# Altium schematic sheet [5]_Power_Supply.SchDoc: Power Supply
size A3; Author: Eladio Delgado Mingorance; CompanyName: Mareldem Technologies; Organization: Mareldem Technologies; Revision: 1.0A; SheetNumber: 5; SheetTotal: 5
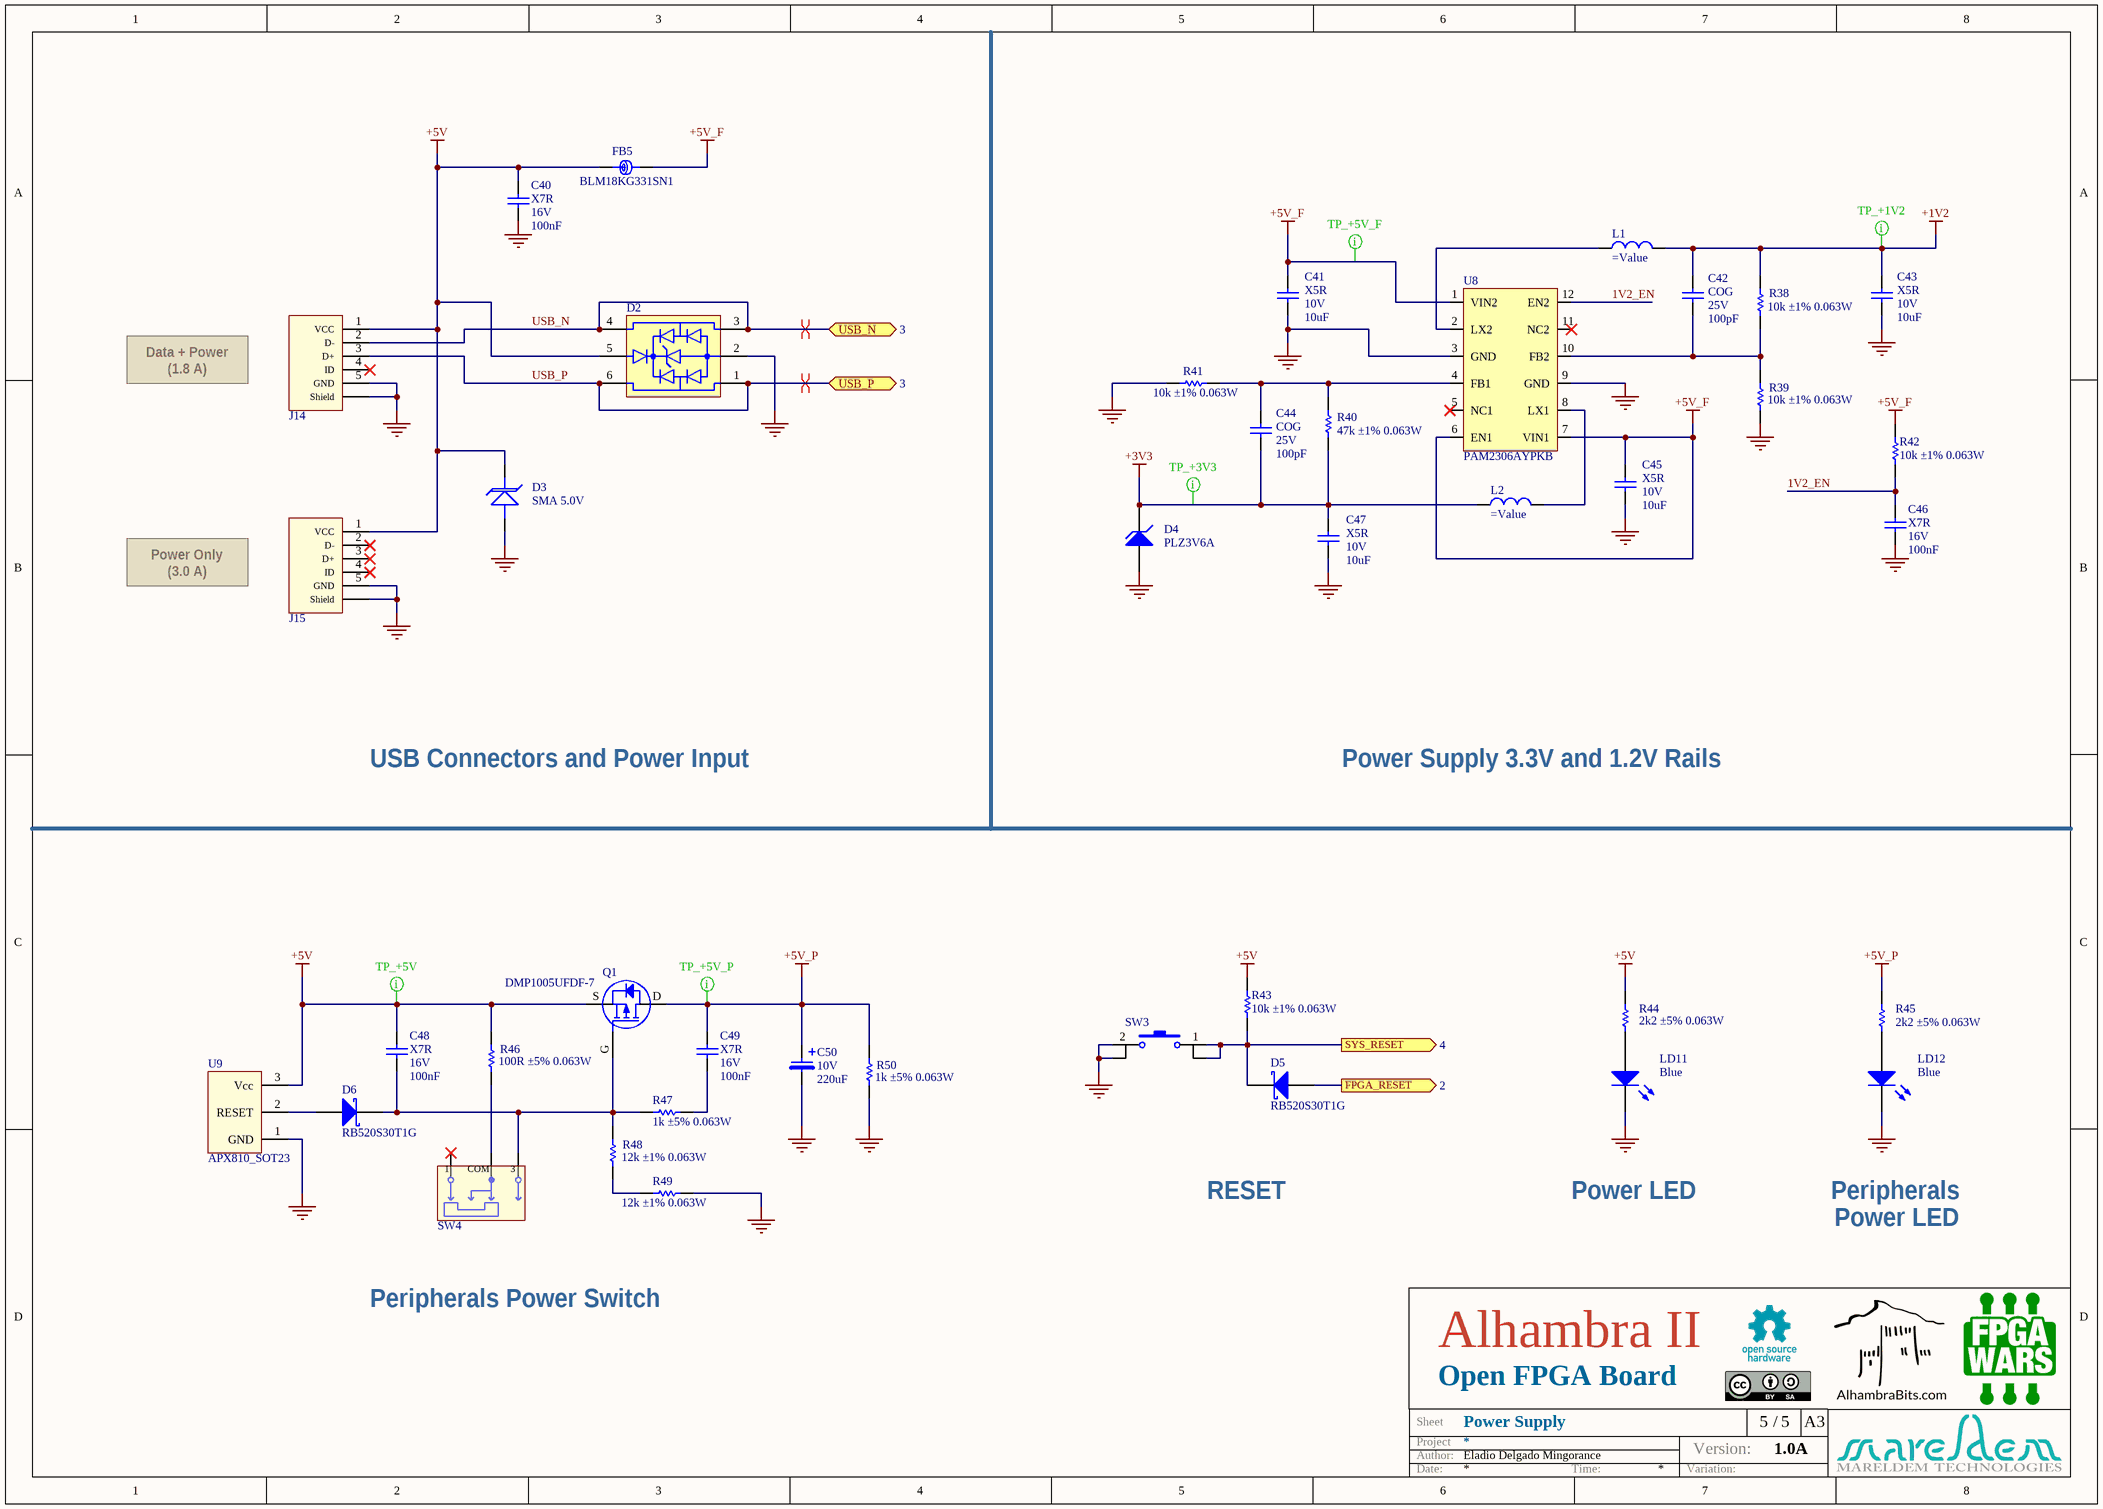
[diagram p0: [5]_Power_Supply.SchDoc]

## Parts
C40  Dielectric: X7R  Voltage: 16V  Capacitance: 100nF  [C0402]  (hidden comment: Capacitor)
C41  Dielectric: X5R  Voltage: 10V  Capacitance: 10uF  [C0805_1.25_HD]  (hidden comment: Capacitor)
C42  Dielectric: COG  Voltage: 25V  Capacitance: 100pF  [C0402]  (hidden comment: Capacitor)
C43  Dielectric: X5R  Voltage: 10V  Capacitance: 10uF  [C0603]  (hidden comment: Capacitor)
C44  Dielectric: COG  Voltage: 25V  Capacitance: 100pF  [C0402]  (hidden comment: Capacitor)
C45  Dielectric: X5R  Voltage: 10V  Capacitance: 10uF  [C0805_1.25_HD]  (hidden comment: Capacitor)
C46  Dielectric: X7R  Voltage: 16V  Capacitance: 100nF  [C0402]  (hidden comment: Capacitor)
C47  Dielectric: X5R  Voltage: 10V  Capacitance: 10uF  [C0805_1.25_HD]  (hidden comment: Capacitor)
C48  Dielectric: X7R  Voltage: 16V  Capacitance: 100nF  [C0402]  (hidden comment: Capacitor)
C49  Dielectric: X7R  Voltage: 16V  Capacitance: 100nF  [C0402]  (hidden comment: Capacitor)
C50  Voltage: 10V  Capacitance: 220uF  [C_POL_6.3x5.8_WE]  (hidden comment: Electrolytic)
D2  ESDUSB  [SOT563]  (value not drawn)
D3  SMA 5.0V  [DO-214AC-SMA_Unidir]
D4  PLZ3V6A  [DO-219AC]
D5  RB520S30T1G  [SOD523]
D6  RB520S30T1G  [SOD523]
FB5  BLM18KG331SN1  [L0603]
J14  629105136821  [629105136821]  (value not drawn)
J15  629105150521  [629105150521]  (value not drawn)
L1  (no value)  [4018_WE_LQS_4R7]
L2  (no value)  [4018_WE_LQS_4R7]
LD11  Blue  [LED0603]
LD12  Blue  [LED0603]
Q1  DMP1005UFDF-7  [U-DFN2020-6]
R38  value 10k ±1% 0.063W  [R0402]  (hidden comment: Resistor)
R39  value 10k ±1% 0.063W  [R0402]  (hidden comment: Resistor)
R40  value 47k ±1% 0.063W  [R0402]  (hidden comment: Resistor)
R41  value 10k ±1% 0.063W  [R0402]  (hidden comment: Resistor)
R42  value 10k ±1% 0.063W  [R0402]  (hidden comment: Resistor)
R43  value 10k ±1% 0.063W  [R0402]  (hidden comment: Resistor)
R44  value 2k2 ±5% 0.063W  [R0402]  (hidden comment: Resistor)
R45  value 2k2 ±5% 0.063W  [R0402]  (hidden comment: Resistor)
R46  value 100R ±5% 0.063W  [R0402]  (hidden comment: Resistor)
R47  value 1k ±5% 0.063W  [R0402]  (hidden comment: Resistor)
R48  value 12k ±1% 0.063W  [R0402]  (hidden comment: Resistor)
R49  value 12k ±1% 0.063W  [R0402]  (hidden comment: Resistor)
R50  value 1k ±5% 0.063W  [R0402]  (hidden comment: Resistor)
SW3  Switch_4P_SP_1-3_4-2  [4363x30458xx]  (value not drawn)
SW4  450404015514  [450404015514]  (value not drawn)
U8  PAM2306AYPKB  [WDFN_12_3x3]
U9  APX810_SOT23  [SOT23-3]

## Ports
FPGA_RESET (out, see 2), SYS_RESET (out, see 4), USB_N (bidir, see 3), USB_P (bidir, see 3)

## Nets
+1V2: C42.2 C43.2 L1.1 R38.2
+3V3: C44.1 C47.2 D4.k(K) L2.2 R40.1
+5V: C40.2 C48.2 D2.5 D3.K FB5.1 J14.1(VCC) J15.1(VCC) Q1.S R43.2 R44.2 R46.2 U9.3(Vcc)
+5V_F: C41.2 C45.2 FB5.2 R42.2 U8.1(VIN2) U8.6(EN1) U8.7(VIN1)
+5V_P: C49.2 C50.1 Q1.D R45.2 R50.2
GND: C40.1 C41.1 C43.1 C45.1 C46.1 C47.1 C50.2 D2.2 D3.A D4.A J14.5(GND) J14.Shell(Shield) J15.5(GND) J15.Shell(Shield) LD11.K LD12.K R39.1 R41.1 R49.2 R50.1 SW3.2 SW3.4 U8.3(GND) U8.9(GND) U9.1(GND)
1V2_EN: C46.2 R42.1 U8.12(EN2)
FPGA_RESET: D5.A ; port FPGA_RESET
SYS_RESET: D5.k(K) R43.1 SW3.1 SW3.3 ; port SYS_RESET
USB_N: D2.3 D2.4 J14.2(D-) ; port USB_N
USB_P: D2.1 D2.6 J14.3(D+) ; port USB_P
NetC42_1: C42.1 R38.1 R39.2 U8.10(FB2)
NetC44_2: C44.2 R40.2 R41.2 U8.4(FB1)
NetC48_1: C48.1 D6.k(K) Q1.G R47.1 R48.1 SW4.3
NetC49_1: C49.1 R47.2
NetD6_A: D6.A U9.2(RESET)
NetL1_2: L1.2 U8.2(LX2)
NetL2_1: L2.1 U8.8(LX1)
NetLD11_A: LD11.A R44.1
NetLD12_A: LD12.A R45.1
NetR46_1: R46.1 SW4.2(COM)
NetR48_2: R48.2 R49.1

Not connected (* = marked no-connect by the designer): J14 4(ID)*; J15 2(D-)* 3(D+)* 4(ID)*; SW4 1*; U8 5(NC1)* 11(NC2)*

## Layout directives
net class Test Points: +1V2, +3V3, +5V, +5V_F, +5V_P
differential pair: USB_N, USB_P

## Notes on the sheet
- Data + Power
  (1.8 A)
- Power Only
  (3.0 A)
- USB Connectors and Power Input
- Power Supply 3.3V and 1.2V Rails
- RESET
- Power LED
- Peripherals
- Peripherals Power Switch
- Alhambra II
- Open FPGA Board
- Project
- Sheet
- Author:
- Version:
- /
- A3
- Date:
- Time:
- Variation:

## Library data of the parts
C40 C46 C48 C49 = C0402_100nF_16V_±10%: Capacitor SMD; Manufacturer: Kemet; Value: 100nF ±10% 16V; Tolerance: ±10%; OrderingCode: C0402C104K4RAC; Temp_ Max: 125; Temp_ Min: -55; Part Number: C0402_100nF_16V_±10%; Price (€): 0,05
C41 C45 C47 = C0805_1.25_HD_10uF_10V_X5R: Capacitor SMD; Manufacturer: Taiyo Yuden; Value: 10uF ±10% 10V; Tolerance: ±10%; OrderingCode: LMK212ABJ106KG; Temp_ Max: 85; Temp_ Min: -55; Part Number: C0805_1.25_HD_10uF_10V_X5R; Price (€): 0,03
C42 C44 = C0402_100pF_25V_±5%: Capacitor SMD; Manufacturer: WE; Value: 100pF ±5% 25V; Tolerance: ±5%; OrderingCode: 885012005046; Temp_ Max: 125; Temp_ Min: -55; Part Number: C0402_100pF_25V_±5%; Price (€): 0,007
C43 = C0603_10uF_10V_±10%: Capacitor SMD; Manufacturer: Murata; Value: 10uF ±10% 10V; Tolerance: ±10%; OrderingCode: GRM188R61A106KE69D; Temp_ Max: 85; Temp_ Min: -55; Part Number: C0603_10uF_10V_±10%; Price (€): 0,027
C50 = Cap_Al_220uF_10V: Capacitor, Electrolytic, SMD; Manufacturer: WE; Value: 220uF 10V; OrderingCode: 875105244013; Temp_ Max: 105; Temp_ Min: -55; Part Number: Cap_Al_220uF_10V; Price (€): 0,3
D2 = USB ESD Single: Protection, USB ESD; Manufacturer: Würth; OrderingCode: 82400152; Temp_ Max: 125; Temp_ Min: -40; OrderingCode 2: CDSOT563-0502; Part Number: USB ESD Single; Supplier: Würth; Price (€): 0,1; Manufacturer 2: Bourns
D3 = TVS 5Vdc Unidir SMA: Protection, Transient Suppression Diode; Manufacturer: WE; Voltage: 5Vdc; Breakdown Voltage: 6,7Vdc; Overvoltage Current: 43,5A; OrderingCode: 824500500; Temp_ Max: 150; Temp_ Min: -65; Part Number: TVS 5Vdc Unidir SMA; Price (€): 0,108
D4 = PLZ3V6A: Zener Diode; Manufacturer: Vishay; Vzener: 3,6V; Tolerance: 0,025; Izener: 20mA; Power: 500mW; Temp_ Max: 150; Temp_ Min: -55; Value: 3,6V; Part Number: PLZ3V6A; OrderingCode: PLZ3V6A; Price (€): 0,07
D5 D6 = RB520S30T1G: Schottky Diode; Manufacturer: On Semiconductor; Ifor: 200mA; Vrrm: 30V; Ifsm: 300mA; Vf: 0,35V; Temp_ Max: 150; Temp_ Min: -55; Value: 200mA 30V; Part Number: RB520S30T1G; OrderingCode: RB520S30T1G; Price (€): 0,017
FB5 = L0603_330R_0,080R_1700 mA: Ferrite Bead; Manufacturer: Murata; Resistance_100MHz: 330R; Resistance_DC: 0,080R; Current: 1700 mA; Temp_ Max: 125; Temp_ Min: -55; Value: 330R 0,080R 1700 mA; Part Number: L0603_330R_0,080R_1700 mA; OrderingCode: BLM18KG331SN1; Price (€): 0,021
J14 = Micro USB 1.8A WE: Micro USB 2.0 SMT Type B Horizontal 5 Contacts WR-COM; Manufacturer: WE; Interface Type: Type B; Gender: Receptacle; Temp_ Max: 105; Temp_ Min: -40; ComponentLink1Description: Manufacturer; ComponentLink1URL: http://www.we-online.de; ComponentLink2Description: Datasheet; ComponentLink2URL: http://katalog.we-online.de/em/datasheet/629105136821.pdf; Part Number: Micro USB 1.8A WE; Published Date: April 2017; Publisher: Wurth Elektronik; Sub-Family: Micro USB 2.0; Type: Horizontal; Construction: SMT; OrderingCode: 629105136821; Supplier: WE; Price (€): 0,26
J15 = Micro USB 3.0A WE: Micro USB 2.0 SMT Type B Horizontal 5 Contacts High Current WR-COM; Manufacturer: WE; Interface Type: Type B; Gender: Receptacle; Temp_ Max: 85; Temp_ Min: -40; ComponentLink1Description: Manufacturer; ComponentLink1URL: http://www.we-online.de; ComponentLink2Description: Datasheet; ComponentLink2URL: http://katalog.we-online.de/em/datasheet/629105150521.pdf; Part Number: Micro USB 3.0A WE; Published Date: April 2017; Publisher: Wurth Elektronik; Sub-Family: Micro USB 2.0; Type: Horizontal; Construction: SMT; OrderingCode: 629105150521; Supplier: WE; Price (€): 0,58
L1 L2 = 4,7uH_1,7A_4018: Inductor SMD; Manufacturer: WE; L: 4,7uH; Rdc: 0,070R; Current: 1,7A; Current Sat#: 2,2A; OrderingCode: 74404042047; Temp_ Max: 125; Temp_ Min: -40; Value: 4,7uH 1,7A; Part Number: 4,7uH_1,7A_4018; Supplier: WE; Price (€): 0,128
LD11 LD12 = LED Blue 0603 Wurth: LED; Manufacturer: WE; OrderingCode: 150 060 BS7 5000; Temp_ Max: 85; Temp_ Min: -40; Part Number: LED Blue 0603 Wurth; Price (€): 0,09; Value: Blue
Q1 = DMP1005UFDF: P-Channel MOSFET; Manufacturer: Diodes Incorporated; Vds: 12V; Vgss: 8V; Id: 26A; Temp_ Max: 150; Temp_ Min: -55; Part Number: DMP1005UFDF; OrderingCode: DMP1005UFDF-7; Price (€): 0,16
R38 R39 R41-R43 = R0402_10k_0.063W_±1%: Resistor, SMD; Manufacturer: Vishay; Tolerance: ±1%; OrderingCode: CRCW040210K0FK; Power: 0.063W; Resistance: 10k; Temp_ Max: 155; Temp_ Min: -55; PackageDescription: SMD; Part Number: R0402_10k_0.063W_±1%; Price (€): 0,006
R40 = R0402_47k_0.063W_±1%: Resistor, SMD; Manufacturer: Vishay; Tolerance: ±1%; OrderingCode: CRCW040247K0FK; Power: 0.063W; Resistance: 47k; Temp_ Max: 155; Temp_ Min: -55; PackageDescription: SMD; Part Number: R0402_47k_0.063W_±1%; Price (€): 0,006
R44 R45 = R0402_2k2_0.063W_±5%: Resistor, SMD; Manufacturer: Vishay; Tolerance: ±5%; OrderingCode: CRCW04022K20JN; Power: 0.063W; Resistance: 2k2; Temp_ Max: 155; Temp_ Min: -55; PackageDescription: SMD; Part Number: R0402_2k2_0.063W_±5%; Price (€): 0,003
R46 = R0402_100R_0.063W_±5%: Resistor, SMD; Manufacturer: Vishay; Tolerance: ±5%; OrderingCode: CRCW0402100RJN; Power: 0.063W; Resistance: 100R; Temp_ Max: 155; Temp_ Min: -55; PackageDescription: SMD; Part Number: R0402_100R_0.063W_±5%; Price (€): 0,003
R47 R50 = R0402_22k_0.063W_±5%: Resistor, SMD; Part Number: R0402_1k_0.063W_±5%; Manufacturer: Vishay; Tolerance: ±5%; OrderingCode: CRCW04021K00JN; Power: 0.063W; Resistance: 1k; Temp_ Max: 155; Temp_ Min: -55; PackageDescription: SMD; Price (€): 0,003
R48 R49 = R0402_12k_0.063W_±1%: Resistor, SMD; Manufacturer: Vishay; Tolerance: ±1%; OrderingCode: CRCW040212K0FK; Power: 0.063W; Resistance: 12k; Temp_ Max: 155; Temp_ Min: -55; PackageDescription: SMD; Part Number: R0402_12k_0.063W_±1%; Price (€): 0,006
SW3 = SW 4,7x3,5 mm SMD side push: Micro miniature pushbutton surface Switch; Manufacturer: WE; OrderingCode: 436353045816; Temp_ Max: 85; Temp_ Min: -40; Part Number: SW 4,7x3,5 mm SMD side push; Supplier: WE; Price (€): 0,2
SW4 = RA Slide Switch: WS-SLSU 6.7x2.7 mm SMD Right Angled, boss design; Manufacturer: WE; Temp_ Max: 85; Temp_ Min: -40; ComponentLink1Description: Manufacturer; ComponentLink1URL: http://www.we-online.de; ComponentLink2Description: Datasheet; ComponentLink2URL: http://katalog.we-online.de/em/datasheet/450404015514.pdf; Part Number: RA Slide Switch; Published Date: March 2017; Publisher: Wurth Elektronik; OrderingCode: 450404015514; Supplier: WE; Price (€): 0,27
U8 = PAM2360: Dual Step-Down DC/DC converter 1A, 1.5 MHz; Manufacturer: Diodes; Voltage IN: 2.5 a 5.5 VDC; Voltage OUT: 1,2 a 3,3 VDC; Current OUT: 1A + 1A; Temp_ Max: 85; Temp_ Min: -40; OrderingCode 2: PAM2306AYPAA; Part Number: PAM2360; OrderingCode: PAM2306AYPKB; Supplier: RS; Price (€): 0,32
U9 = APX810: Voltage supervisor, Reset active high, 200ms; Part Number: APX810; Manufacturer: Diodes Incorporated; OrderingCode: APX810-29SAG-7; Temp_ Max: 105; Temp_ Min: -40; Value: 2,93V; Supplier: Silica; Price (€): 0,1